# Altium schematic sheet Sensing - HAL Sensor.SchDoc: [15] Sensing - HAL Sensor
size A4; ApprovedBy: Nagy Richard; CheckedBy: Nagy Richard; Author: Nagy Richard; CompanyName: EmbedCore; DrawnBy: Nagy Richard; Engineer: Nagy Richard; Organization: EmbedCore; DocumentNumber: 15; Revision: 1.0; SheetNumber: 13; SheetTotal: 24
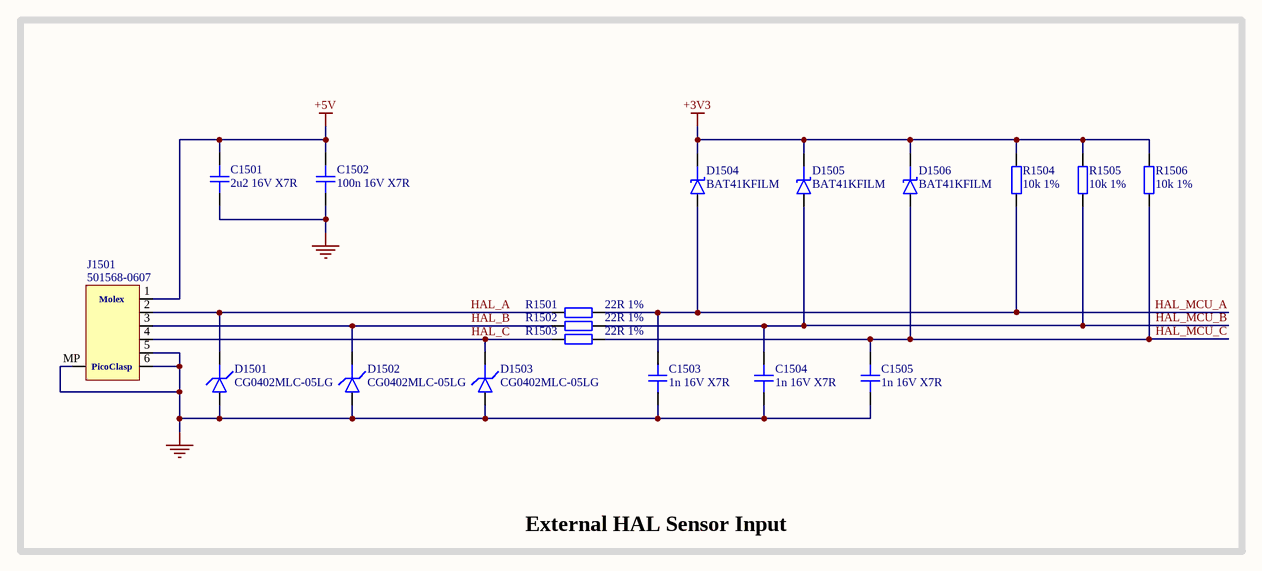
[diagram p0: Sensing - HAL Sensor.SchDoc]

## Parts
C1501  2u2 16V X7R  [CAP_0603]
C1502  100n 16V X7R  [CAP_0402]
C1503  1n 16V X7R  [CAP_0402]
C1504  1n 16V X7R  [CAP_0402]
C1505  1n 16V X7R  [CAP_0402]
D1501  CG0402MLC-05LG  [D_0402]
D1502  CG0402MLC-05LG  [D_0402]
D1503  CG0402MLC-05LG  [D_0402]
D1504  BAT41KFILM  [SOD-523]
D1505  BAT41KFILM  [SOD-523]
D1506  BAT41KFILM  [SOD-523]
J1501  501568-0607  [501568-0607]
R1501  22R 1%  [RES_0402]
R1502  22R 1%  [RES_0402]
R1503  22R 1%  [RES_0402]
R1504  10k 1%  [RES_0402]
R1505  10k 1%  [RES_0402]
R1506  10k 1%  [RES_0402]

## Blocks framed on the sheet
External HAL Sensor Input: C1501-C1505 D1501-D1506 J1501 R1501-R1506

## Nets
+3V3: D1504.K D1505.K D1506.K R1504.2 R1505.2 R1506.2
+5V: C1501.2 C1502.2 J1501.1
GND: C1501.1 C1502.1 C1503.1 C1504.1 C1505.1 D1501.A D1502.A D1503.A J1501.5 J1501.6 J1501.MP
HAL_A: D1501.K J1501.2 R1501.2
HAL_B: D1502.K J1501.3 R1502.2
HAL_C: D1503.K J1501.4 R1503.2
HAL_MCU_A: C1503.2 D1504.A R1501.1 R1504.1
HAL_MCU_B: C1504.2 D1505.A R1502.1 R1505.1
HAL_MCU_C: C1505.2 D1506.A R1503.1 R1506.1

## Notes on the sheet
- Title:
- Drawn By:
- Page Contents:
- Checked By:
- Size:
- Date:
- File:
- License:
- Email:
- A4
- Number:
- Time:
- Revision:
- Sheet
- Website:
- of
- (in symbol 501568-0607) PicoClasp

## Library data of the parts
C1501 = CAP_0603: Capacitor SMD 0603; Manufacturer: YAGEO; Manufacturer Part Number: CC0603KRX7R7BB225; Distributor Link: www.lcsc.com; LCSC: C914769; Rating: *; Dielectric: *
C1502 = CAP_0402: Capacitor SMD 0402; Manufacturer: YAGEO; Manufacturer Part Number: CC0402JRX7R7BB104; Distributor Link: www.lcsc.com; LCSC: C541464; Rating: *; Dielectric: *
C1503-C1505 = CAP_0402: Capacitor SMD 0402; Manufacturer: YAGEO; Manufacturer Part Number: CC0402KRX7R7BB102; Distributor Link: www.lcsc.com; LCSC: C189467; Rating: *; Dielectric: *
D1501 = D_TVS_0402: Diode TVS / ESD 0402; Manufacturer: BOURNS; Manufacturer Part Number: CG0402MLC-05LG; LCSC: C711709
D1502 D1503 = D_TVS_0402: Diode TVS / ESD 0402
D1504-D1506 = D_SCHOTTKY_SOD_523: Diode Schottky SMD SOD-323; Manufacturer: STMicroelectronics; Manufacturer Part Number: BAT41KFILM; LCSC: C73150
J1501 = 501568-0607: 1.00mm Pitch, Pico-Clasp PCB Header, Single Row, Right-Angle, Surface Mount, Tin Plated, Outer Positive Lock, 6 Circuits, Natural; Manufacturer: Molex; Manufacturer Part Number: 501568-0607
R1501-R1503 = RES_0402: Resistor SMD 0402; Manufacturer: PANASONIC; Manufacturer Part Number: ERJPA2F22R0X; Distributor Link: www.lcsc.com; LCSC: C427230
R1504-R1506 = RES_0402: Resistor SMD 0402; Manufacturer: PANASONIC; Manufacturer Part Number: ERJPA2F1002X; Distributor Link: www.lcsc.com; LCSC: C427247